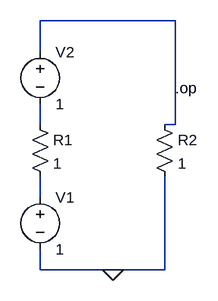
[diagram p0: schematic Draft3.asc]
Draft3.asc, the LTspice schematic file:
Version 4
SHEET 1 880 680
WIRE 384 112 176 112
WIRE 176 160 176 112
WIRE 176 272 176 240
WIRE 384 272 384 112
WIRE 384 272 368 272
WIRE 176 384 176 352
WIRE 176 496 176 464
WIRE 288 496 176 496
WIRE 368 496 368 352
WIRE 368 496 288 496
FLAG 288 496 0
SYMBOL voltage 176 368 R0
SYMATTR InstName V1
SYMATTR Value 1
SYMBOL voltage 176 144 R0
SYMATTR InstName V2
SYMATTR Value 1
SYMBOL res 160 256 R0
SYMATTR InstName R1
SYMATTR Value 1
SYMBOL res 352 256 R0
SYMATTR InstName R2
SYMATTR Value 1
TEXT 384 216 Left 2 !.op

The netlist it stands for:
* Draft3.asc
V1 N003 0 1
V2 N001 N002 1
R1 N002 N003 1
R2 N001 0 1
.op
.backanno
.end